# EAGLE design RF22BController_v01 (EAGLE 6.4)
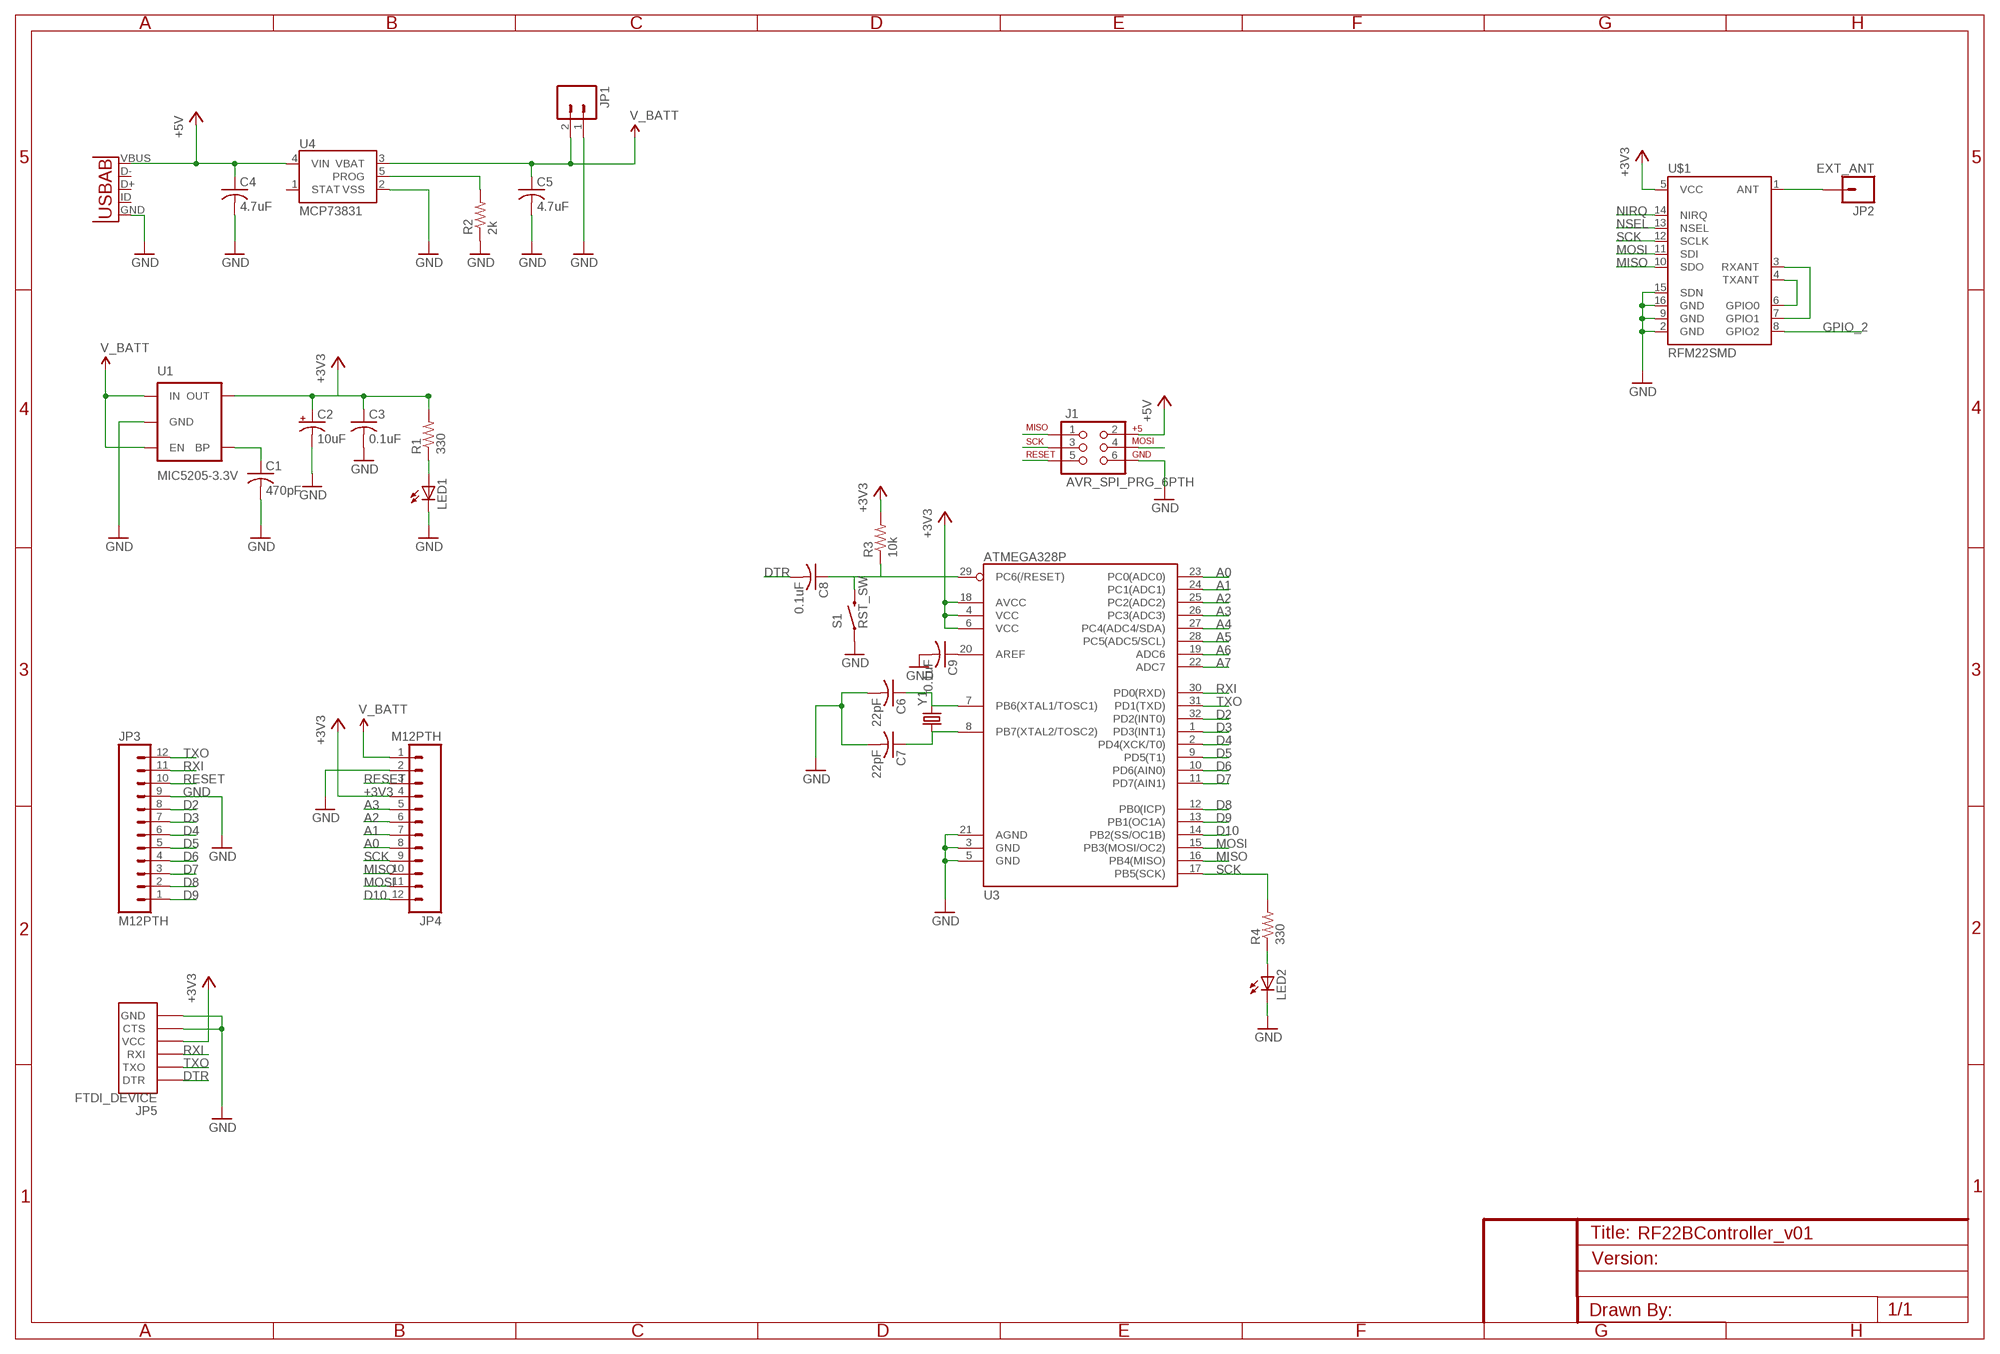
[diagram p0: schematic, sheet 1]

## Parts
C1  470pF  C-USC0805  [C0805]
C2  10uF  CPOL-USCT6032  [CT6032]
C3  0.1uF  C-USC0805  [C0805]
C4  4.7uF  C-USC0805  [C0805]
C5  4.7uF  C-USC0805  [C0805]
C6  22pF  C-USC0805  [C0805]
C7  22pF  C-USC0805  [C0805]
C8  0.1uF  C-USC0805  [C0805]
C9  0.1uF  C-USC0805  [C0805]
J1  AVR_SPI_PRG_6PTH  [2X3]
JP1  M02-JST-2MM-SMT  [JST-2-SMD]
JP2  EXT_ANT  M01PTH  [1X01]
JP3  M12PTH  [1X12]
JP4  M12PTH  [1X12]
JP5  FTDI_DEVICE  [FTDI_DEVICE_SIDE]
LED1  LEDCHIP-LED0603  [CHIP-LED0603]
LED2  LEDCHIP-LED0603  [CHIP-LED0603]
R1  330  R-US_M0805  [M0805]
R2  2k  R-US_M0805  [M0805]
R3  10k  R-US_M0805  [M0805]
R4  330  R-US_M0805  [M0805]
S1  RST_SW  SWITCH-MOMENTARY-2  [TACTILE_SWITCH_TALL]
U1  MIC5205-3.3V  MIC52053.3V  [SOT23-5]
U2  USB-AB  [USB-AB-MICRO-SMD]
U3  ATMEGA328P  ATMEGA328_SMT  [TQFP32-08]
U4  MCP73831  [SOT23-5]
U$1  RFM22SMD  [RFM22-XXX-S2]
Y1  CRYSTALTXC-7A  [CRYSTAL-TXC-7A]

## Nets
+3V3: C2.+ C3.1 JP4.4 JP5.P$4(VCC) R1.2 R3.2 U1.5(OUT) U3.4(VCC) U3.6(VCC) U3.18(AVCC) U$1.5(VCC)
+5V: C4.1 J1.2 U2.VBUS U4.4(VIN)
A0: JP4.8 U3.23(PC0(ADC0))
A1: JP4.7 U3.24(PC1(ADC1))
A2: JP4.6 U3.25(PC2(ADC2))
A3: JP4.5 U3.26(PC3(ADC3))
A4: U3.27(PC4(ADC4/SDA))
A5: U3.28(PC5(ADC5/SCL))
A6: U3.19(ADC6)
A7: U3.22(ADC7)
D2: JP3.8 U3.32(PD2(INT0))
D3: JP3.7 U3.1(PD3(INT1))
D4: JP3.6 U3.2(PD4(XCK/T0))
D5: JP3.5 U3.9(PD5(T1))
D6: JP3.4 U3.10(PD6(AIN0))
D7: JP3.3 U3.11(PD7(AIN1))
D8: JP3.2 U3.12(PB0(ICP))
D9: JP3.1 U3.13(PB1(OC1A))
D10: JP4.12 U3.14(PB2(SS/OC1B))
DTR: C8.2 JP5.P$1(DTR)
GND: C1.2 C2.- C3.2 C4.2 C5.2 C6.2 C7.2 C9.2 J1.6 JP1.1 JP3.9 JP4.2 JP5.P$5(CTS) JP5.P$6(GND) LED1.C LED2.C R2.1 S1.A2 U1.2(GND) U2.GND U3.3(GND) U3.5(GND) U3.21(AGND) U4.2(VSS) U$1.2(GND) U$1.9(GND) U$1.15(SDN) U$1.16(GND)
GPIO_2: U$1.8(GPIO2)
MISO: J1.1 JP4.10 U3.16(PB4(MISO)) U$1.10(SDO)
MOSI: J1.4 JP4.11 U3.15(PB3(MOSI/OC2)) U$1.11(SDI)
N$1: C1.1 U1.4(BP)
N$3: LED1.A R1.1
N$5: U$1.3(RXANT) U$1.7(GPIO1)
N$6: U$1.4(TXANT) U$1.6(GPIO0)
N$7: R2.2 U4.5(PROG)
N$8: C9.1 U3.20(AREF)
N$9: JP2.1 U$1.1(ANT)
N$32: C6.1 U3.7(PB6(XTAL1/TOSC1)) Y1.P$2
N$33: C7.1 U3.8(PB7(XTAL2/TOSC2)) Y1.P$1
N$34: LED2.A R4.1
NIRQ: U$1.14(NIRQ)
NSEL: U$1.13(NSEL)
RESET: C8.1 J1.5 JP3.10 JP4.3 R3.1 S1.B2 U3.29(PC6(/RESET))
RXI: JP3.11 JP5.P$3(RXI) U3.30(PD0(RXD))
SCK: J1.3 JP4.9 R4.2 U3.17(PB5(SCK)) U$1.12(SCLK)
TXO: JP3.12 JP5.P$2(TXO) U3.31(PD1(TXD))
V_BATT: C5.1 JP1.2 JP4.1 U1.1(IN) U1.3(EN) U4.3(VBAT)
Unconnected: U2.D+ U2.D- U2.ID(USBID) U4.1(STAT)

## Library data of the parts
C1 C3-C9 = rcl:C-US: CAPACITOR, American symbol
C2 = rcl:CPOL-US: POLARIZED CAPACITOR, American symbol
J1 = SparkFun-Connectors:AVR_SPI_PRG_6: AVR ISP 6 Pin This is the reduced ISP connector for AVR programming. Common on Arduino. This footprint will take up less PCB space and can be used with a 10-pin to 6-pin adapter such as SKU: BOB-08508
JP1 = SparkFun-Connectors:M02: Header 2 Standard 2-pin 0.1" header. Use with straight break away headers (SKU : PRT-00116), right angle break away headers (PRT-00553), swiss pins (PRT-00743), machine pins (PRT-00117), and female headers (PRT-00115). Molex polarized connector foot print use with SKU : PRT-08233 with associated crimp pins and housings.; PROD_ID: CONN-08352
JP2 = SparkFun-Connectors:M01: Header 1 Standard 1-pin 0.1" header. Use with straight break away headers (SKU : PRT-00116), right angle break away headers (PRT-00553), swiss pins (PRT-00743), machine pins (PRT-00117), and female headers (PRT-00115).
JP3 JP4 = SparkFun-Connectors:M12: Header 12 Standard 12-pin 0.1" header. Use with straight break away headers (SKU : PRT-00116), right angle break away headers (PRT-00553), swiss pins (PRT-00743), machine pins (PRT-00117), and female headers (PRT-00115).
JP5 = SparkFun-Connectors:FTDI_DEVICE: Connector which mates to FTDI basic or FTDI cable.
LED1 LED2 = led:LED: LED OSRAM: - CHIPLED LG R971, LG N971, LY N971, LG Q971, LY Q971, LO R971, LY R971 LH N974, LH R974 LS Q976, LO Q976, LY Q976 LO Q996 - Hyper CHIPLED LW Q18S LB Q993, LB Q99A, LB R99A - SideLED LS A670, LO A670, LY A670, LG A670, LP A670 LB A673, LV A673, LT A673, LW A673 LH A674 LY A675 LS A676, LA A676, LO A676, LY A676, LW A676 LS A679, LY A679, LG A679 - Hyper Micro SIDELED® LS Y876, LA Y876, LO Y876, LY Y876 LT Y87S - SmartLED LW L88C, LW L88S LB L89C, LB L89S, LG L890 LS L89K, LO L89K, LY L89K LS L896, LA L896, LO L896, LY L896 - TOPLED LS T670, LO T670, LY T670, LG T670, LP T670 LSG T670, LSP T670, LSY T670, LOP T670, LYG T670 LG T671, LOG T671, LSG T671 LB T673, LV T673, LT T673, LW T673 LH T674 LS T676, LA T676, LO T676, LY T676, LB T676, LH T676, LSB T676, LW T676 LB T67C, LV T67C, LT T67C, LS T67K, LO T67K, LY T67K, LW E67C LS E67B, LA E67B, LO E67B, LY E67B, LB E67C, LV E67C, LT E67C LW T67C LS T679, LY T679, LG T679 LS T770, LO T770, LY T770, LG T770, LP T770 LB T773, LV T773, LT T773, LW T773 LH T774 LS E675, LA E675, LY E675, LS T675 LS T776, LA T776, LO T776, LY T776, LB T776 LHGB T686 LT T68C, LB T68C - Hyper Mini TOPLED® LB M676 - Mini TOPLED Santana® LG M470 LS M47K, LO M47K, LY M47K Source: http://www.osram.convergy.de LUXEON: - LUMILED® LXK2-PW12-R00, LXK2-PW12-S00, LXK2-PW14-U00, LXK2-PW14-V00 LXK2-PM12-R00, LXK2-PM12-S00, LXK2-PM14-U00 LXK2-PE12-Q00, LXK2-PE12-R00, LXK2-PE12-S00, LXK2-PE14-T00, LXK2-PE14-U00 LXK2-PB12-K00, LXK2-PB12-L00, LXK2-PB12-M00, LXK2-PB14-N00, LXK2-PB14-P00, LXK2-PB14-Q00 LXK2-PR12-L00, LXK2-PR12-M00, LXK2-PR14-Q00, LXK2-PR14-R00 LXK2-PD12-Q00, LXK2-PD12-R00, LXK2-PD12-S00 LXK2-PH12-R00, LXK2-PH12-S00 LXK2-PL12-P00, LXK2-PL12-Q00, LXK2-PL12-R00 Source: www.luxeon.com KINGBRIGHT: KA-3528ASYC Source: www.kingbright.com
R1-R4 = rcl:R-US_: RESISTOR, American symbol
S1 = SparkFun-Electromechanical:SWITCH-MOMENTARY-2: Various NO switches- pushbuttons, reed, etc
U1 = SparkFun-PowerIC:MIC5205: MIC5205 150mA vreg 3.3V - VREG-00822 5V - VREG-00823; PROD_ID: VREG-00822
U2 = SparkFun-Connectors:USB-AB: This is a USB AB connector that is compatible with USB OTG. i.e. this connector can serve as a host or device
U3 = SparkFun-DigitalIC:ATMEGA328_SMT: 32-Pin Atmega328 part Commonly used on Arduino compatible boards Available in QFP and QFN packages TQFP is IC-09069 QFN is non-stock; PROD_ID: IC-09069
U4 = SparkFun-PowerIC:MCP73831: Miniature single cell, fully integrated Li-Ion, Li-polymer charge management controller http://ww1.microchip.com/downloads/en/DeviceDoc/21984a.pdf IC-09995; PROD_ID: IC-09995
U$1 = SparkFun-RF:RFM22: The RFM22 is a low-power, low cost radio that is capable of operating in the 434MHz and 900MHz open bands. It's frequency is software defined and there are some very good libraries written for it.
Y1 = SparkFun-FreqCtrl:CRYSTAL: Various standard crystals. Proven footprints. Spark Fun Electronics SKU : COM-00534

## Board
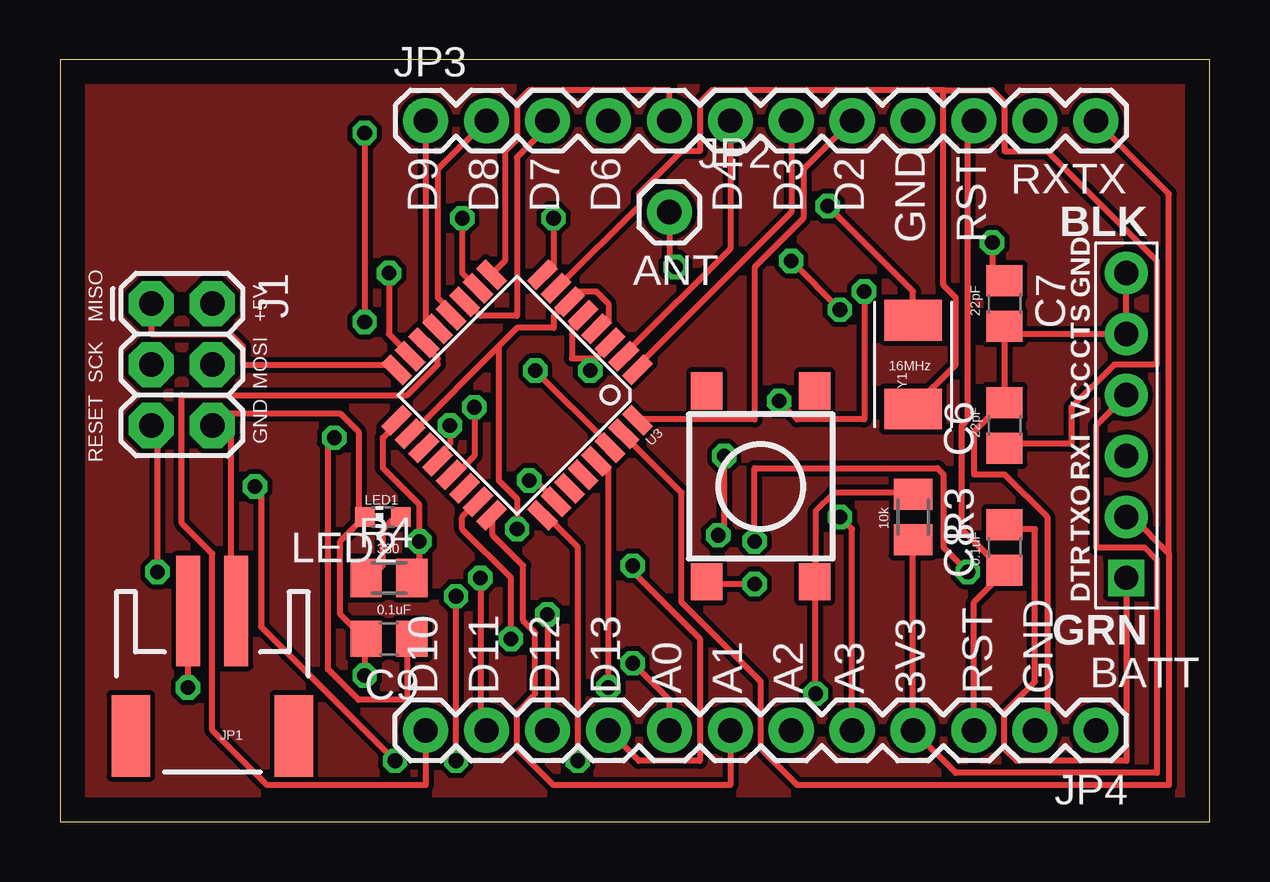
[diagram p1: board, top side]
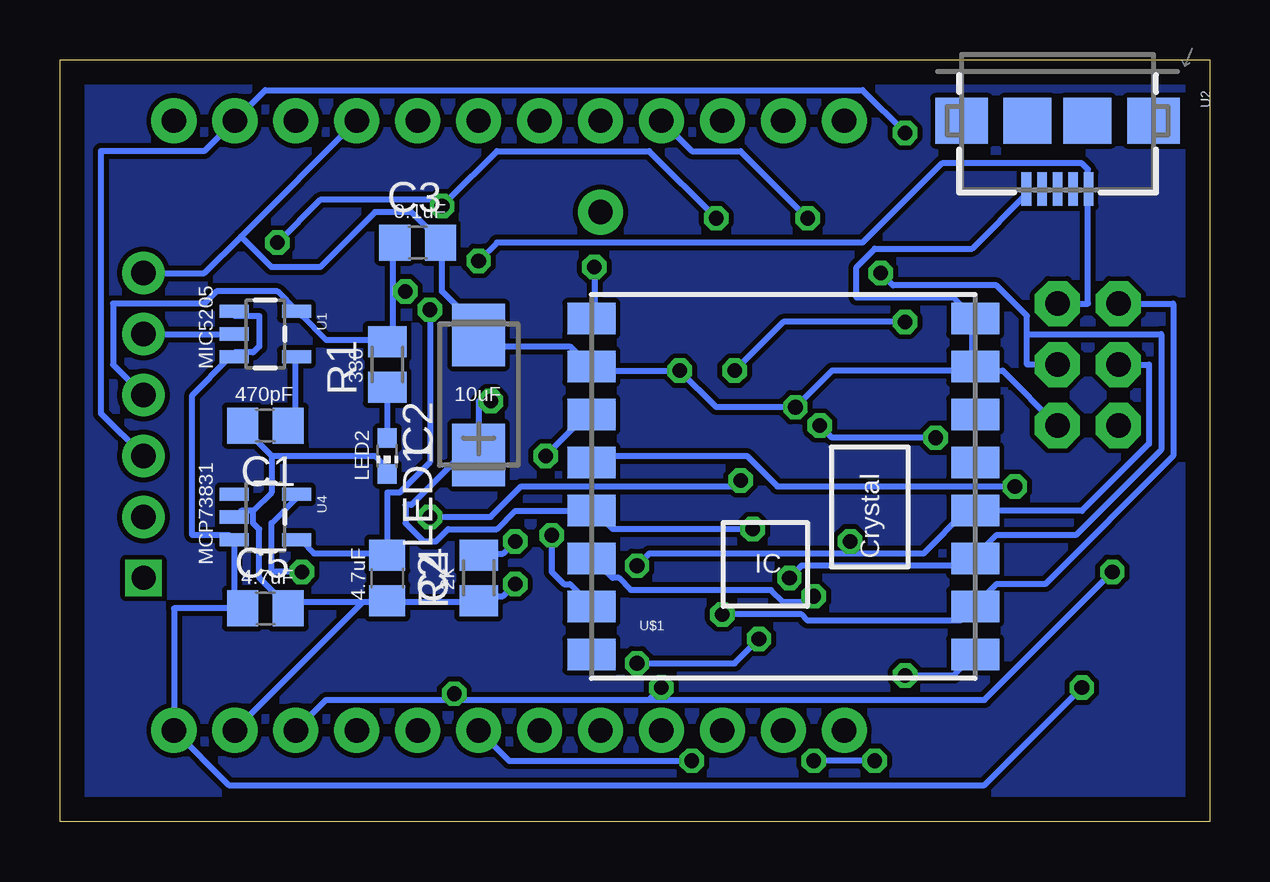
[diagram p2: board, bottom side, seen from below]

Size 47.93 x 31.74 mm. Coordinates in mm from the lower left corner, seen from the top.
Outline: 0,0 47.93,0 47.93,31.74 0,31.74 0,0
Copper layers (1*16): Top 0.035mm / dielectric 1.5mm / Bottom 0.035mm
Design rules "default": minimum track width 10mil, minimum drill 24mil, track to track 8mil, track to pad 8mil, pad to pad 8mil, via to via 8mil, smd to smd 8mil, copper to edge 40mil, drill to drill 8mil, minimum pad ring 10mil, minimum via ring 8mil, stop-mask expansion 4mil, vias tented up to drill 0mil, thermal gap 10mil

### Footprints (pad centres in the part's own frame; a part is rotated, then mirrored left to right if it is on the bottom)
C0805 = smd 1.3 x 1.5: 1 -0.95,0; 2 0.95,0
CT6032 = smd 2.6 x 2.2: + -2.5,0; - 2.5,0
2X3 = drill 1.016 pad 1.88 octagon: 1 0,0; 2 0,2.54; 3 2.54,0; 4 2.54,2.54; 5 5.08,0; 6 5.08,2.54
JST-2-SMD = smd 1 x 4.6: 1 -1,-3.7; 2 1,-3.7 | smd 1.6 x 3.4: NC1 -3.4,1.5; NC2 3.4,1.5
1X01 = drill 1.016 pad 1.88: 1 0,0
1X12 = drill 1.016 pad 1.88: 1 0,0; 2 2.54,0; 3 5.08,0; 4 7.62,0; 5 10.16,0; 6 12.7,0; 7 15.24,0; 8 17.78,0; 9 20.32,0; 10 22.86,0; 11 25.4,0; 12 27.94,0
FTDI_DEVICE_SIDE = drill 1 square: P$1 -6.35,0 | drill 1.016 pad 1.778: P$2 -3.81,0; P$3 -1.27,0; P$4 1.27,0; P$5 3.81,0; P$6 6.35,0
CHIP-LED0603 = smd 0.8 x 0.8: A 0,-0.75; C 0,0.75
M0805 = smd 1.3 x 1.6: 1 -0.95,0; 2 0.95,0
TACTILE_SWITCH_TALL = smd 1.55 x 1.3: A1 -3.975,-2.25; A2 3.975,-2.25; B1 -3.975,2.25; B2 3.975,2.25
SOT23-5 = smd 0.55 x 1.2: 1 -0.95,-1.3; 2 0,-1.3; 3 0.95,-1.3; 4 0.95,1.3; 5 -0.95,1.3
USB-AB-MICRO-SMD = smd 1.4 x 0.4: D+ 2.85,0; D- 2.85,0.65; GND 2.85,-1.3; ID 2.85,-0.65; VBUS 2.85,1.3 | smd 1.9 x 2: P$6 0,1.25; P$7 0,-1.25 | smd 1.9 x 2.2: P$8 0,4; P$9 0,-4
TQFP32-08 = smd 1.27 x 0.559: 1 -4.293,2.8; 2 -4.293,2; 3 -4.293,1.2; 4 -4.293,0.4; 5 -4.293,-0.4; 6 -4.293,-1.2; 7 -4.293,-2; 8 -4.293,-2.8; 17 4.293,-2.8; 18 4.293,-2; 19 4.293,-1.2; 20 4.293,-0.4; 21 4.293,0.4; 22 4.293,1.2; 23 4.293,2; 24 4.293,2.8 | smd 0.559 x 1.27: 9 -2.8,-4.293; 10 -2,-4.293; 11 -1.2,-4.293; 12 -0.4,-4.293; 13 0.4,-4.293; 14 1.2,-4.293; 15 2,-4.293; 16 2.8,-4.293; 25 2.8,4.293; 26 2,4.293; 27 1.2,4.293; 28 0.4,4.293; 29 -0.4,4.293; 30 -1.2,4.293; 31 -2,4.293; 32 -2.8,4.293
RFM22-XXX-S2 = smd 2 x 1.3: 1 -8,7; 2 -8,5; 3 -8,3; 4 -8,1; 5 -8,-1; 6 -8,-3; 7 -8,-5; 8 -8,-7; 9 8,-7; 10 8,-5; 11 8,-3; 12 8,-1; 13 8,1; 14 8,3; 15 8,5; 16 8,7
CRYSTAL-TXC-7A = smd 1.7 x 2.4: P$1 1.85,0; P$2 -1.85,0

### Placement (x,y rotation side)
C1  39.37,16.51 180 bottom
C2  30.48,17.78 90 bottom
C3  33.02,24.13 0 bottom
C4  34.29,10.16 270 bottom
C5  39.37,8.89 0 bottom
C6  39.37,16.51 90 top
C7  39.37,21.59 270 top
C8  39.37,11.43 90 top
C9  13.72,7.62 180 top
J1  3.81,21.59 270 top
JP1  6.35,5.08 180 top
JP2  25.4,25.4 0 top
JP3  15.24,29.21 0 top
JP4  43.18,3.81 180 top
JP5  44.45,16.51 90 top
LED1  34.29,15.24 180 bottom
LED2  13.46,12.7 90 top
R1  34.29,19.05 90 bottom
R2  30.48,10.16 90 bottom
R3  35.56,12.7 270 top
R4  13.72,10.16 0 top
S1  29.21,13.97 270 top
U1  39.37,20.32 270 bottom
U2  6.35,29.21 270 bottom
U3  19.05,17.78 225 top
U4  39.37,12.7 270 bottom
U$1  17.78,13.97 0 bottom
Y1  35.56,19.05 90 top

### Tracks (layer width: path | path; a pad name or v marks a point on that pad's centre or on a via)
+3V3  (via drill 0.61)
  Top 0.254: 18.29,19.81 19.05,20.57 20.57,20.57 20.57,21.08 21.08,21.59 U3.6 21.34,21.84 21.59,22.1 22.35,22.1 22.86,21.59 22.86,20.83 22.61,20.57 U3.4 | 18.29,19.81 14.73,16.26 U3.18 | v19.05,12.19 19.05,13.46 18.29,14.22 18.29,19.81 | R3.2 JP4.4 37.34,2.03 45.72,2.03 45.72,10.92 45.21,11.43 43.18,11.43 43.18,16.51 JP5.P$4 | v29.97,17.53 30.73,16.76 33.53,16.76 v33.53,22.1
  Bottom 0.254: v19.05,12.19 24.89,12.19 25.65,12.95 U$1.5 25.91,12.95 28.96,12.95 29.72,12.19 31.75,12.19 32.26,11.68 32.77,11.68 33.53,12.45 33.53,13.21 33.27,13.21 31.24,15.24 30.48,15.24 C2.+ 30.48,17.53 v29.97,17.53 | 34.29,20.07 36.83,20.07 37.85,21.08 U1.5 38.1,21.34 38.86,22.1 41.4,22.1 41.91,21.59 45.72,21.59 45.72,19.05 JP5.P$4 | 34.04,22.1 34.04,20.07 34.29,20.07 | 34.04,22.1 34.04,24.13 C3.1 | 34.29,20.07 R1.2 | 34.04,22.1 v33.53,22.1
+5V  (via drill 0.61)
  Top 0.254: v30.48,23.37 v32.51,21.34
  Bottom 0.254: 34.29,11.18 37.34,11.18 37.85,11.68 U4.4 | J1.2 5.08,21.59 5.08,26.16 U2.VBUS 5.08,26.42 5.08,27.18 5.33,27.43 11.18,27.43 14.48,24.13 29.72,24.13 v30.48,23.37 | 34.29,11.18 34.29,13.72 33.78,13.72 32.51,14.99 v32.51,21.34 | 34.29,11.18 C4.1
A0  (via drill 0.61)
  Top 0.254: v18.8,7.62 18.8,10.16 16.76,12.19 16.76,12.7 17.27,13.21 U3.23 | v23.88,6.6 25.4,5.08 JP4.8
  Bottom 0.254: v18.8,7.62 19.81,6.6 v23.88,6.6
A1
  Top 0.254: JP4.7 27.94,1.52 20.57,1.52 19.05,3.05 19.05,4.57 19.81,5.33 19.81,7.87 19.3,8.38 19.3,10.67 18.03,11.94 18.03,12.7 U3.24
A2  (via drill 0.61)
  Top 0.254: v21.59,2.54 21.59,11.43 20.32,12.7 U3.25
  Bottom 0.254: v21.59,2.54 29.21,2.54 JP4.6
A3  (via drill 0.61)
  Top 0.254: v19.56,14.22 19.81,14.22 20.57,13.46 U3.26 | v32.51,12.7 33.02,12.19 JP4.5
  Bottom 0.254: v19.56,14.22 19.81,13.97 28.7,13.97 29.97,12.7 v32.51,12.7
D2
  Top 0.254: JP3.8 30.99,27.18 30.99,25.15 28.96,23.11 28.96,16.76 24.13,16.76 U3.32
D3
  Top 0.254: JP3.7 30.48,25.4 24.13,19.05 U3.1
D4
  Top 0.254: JP3.6 27.94,23.88 23.62,19.56 U3.2
D5
  Top 0.254: JP3.5 25.4,30.48 19.56,30.48 19.05,29.97 19.05,28.45 18.54,27.94 18.54,23.37 18.03,22.86 U3.9
D6  (via drill 0.61)
  Top 0.254: v16.76,25.15 16.76,22.86 17.27,22.35 U3.10
  Bottom 0.254: v16.76,25.15 19.56,27.94 21.59,27.94 JP3.4
D7
  Top 0.254: JP3.3 20.32,28.96 19.05,27.69 19.05,21.08 17.53,21.08 17.02,21.59 U3.11
D8
  Top 0.254: JP3.2 15.75,27.18 15.75,21.84 16.26,21.34 U3.12
D9
  Top 0.254: JP3.1 15.24,20.83 15.49,20.57 U3.13
D10
  Top 0.254: JP4.12 15.24,1.52 8.64,1.52 6.35,3.81 6.35,11.18 5.08,12.45 5.08,17.78 14.48,17.78 15.75,19.05 15.75,19.3 15.24,19.81 U3.14
DTR
  Top 0.254: JP5.P$1 44.45,2.54 39.88,2.54 39.37,3.05 39.37,4.57 40.64,5.84 40.64,12.19 39.37,12.19 C8.2
GND  (via drill 0.61)
  Top 0.254: v28.96,9.91 27.18,9.91 S1.A2 | 39.37,20.32 C7.2 39.37,20.57 | 39.37,20.32 39.37,17.53 | 39.37,20.32 JP5.P$5 JP5.P$6 | 22.1,19.3 21.34,19.3 21.34,20.83 21.59,21.08 U3.5 | 22.1,19.3 22.35,19.3 22.86,19.81 U3.3 | v22.1,18.8 22.1,19.3 | LED2.C 11.68,11.68 11.68,8.64 12.7,7.62 | 12.7,7.62 v12.7,6.1 | 12.7,7.62 C9.2 | v17.27,17.27 17.27,15.24 16.51,14.48 U3.21 | LED2.C 12.45,12.95 12.45,16.26 11.68,17.02 7.11,17.02 | 7.11,17.02 6.35,17.02 J1.6 7.11,17.02 | LED2.C | 7.11,17.02 7.11,8.89 JP1.1 | JP4.2 41.15,4.32 41.15,12.7 39.37,14.48 38.1,14.48 38.1,16.26 39.37,17.53 | 39.37,17.53 C6.2
  Bottom 0.254: 39.12,15.24 34.8,15.24 34.29,14.73 LED1.C | 39.12,15.24 40.39,16.51 C1.2 | 39.88,12.95 40.39,12.95 40.64,12.7 U4.2 | 39.88,12.95 39.12,13.72 39.12,15.24 | 34.29,9.14 30.48,9.14 R2.1 30.48,9.4 29.46,9.4 v28.96,9.91 | 38.35,8.89 38.1,9.14 35.31,9.14 | 34.29,9.14 35.31,9.14 | 34.29,9.14 C4.2 | 35.31,9.14 JP4.2 | 39.88,12.95 39.88,12.45 39.62,12.19 39.62,10.16 38.35,8.89 | 38.35,8.89 C5.2 | JP5.P$5 U1.2 | 40.39,24.38 41.91,22.86 JP5.P$6 | 40.39,24.38 JP3.9 | 32,24.13 32,22.1 30.48,20.57 C2.- 30.48,20.07 30.23,19.81 26.67,19.81 25.91,19.05 U$1.2 25.65,18.8 v22.1,18.8 20.57,17.27 v17.27,17.27 15.75,18.8 9.91,18.8 U$1.15 | U2.GND 7.62,26.16 9.91,23.88 13.97,23.88 14.73,23.11 14.73,21.84 10.67,21.84 9.91,21.08 U$1.16 9.91,20.83 9.91,19.05 U$1.15 | v12.7,6.1 10.67,6.1 9.91,6.86 U$1.9 | J1.6 8.64,18.8 9.65,18.8 U$1.15 | 40.39,24.38 39.12,23.11 37.08,23.11 34.8,25.4 33.27,25.4 32,24.13 | 32,24.13 C3.2
MISO  (via drill 0.61)
  Top 0.254: J1.1 3.81,20.32 7.11,20.32 7.62,19.81 7.62,19.05 13.97,19.05 U3.16 | v20.32,8.64 JP4.10
  Bottom 0.254: J1.1 1.52,21.59 1.52,15.24 6.86,9.91 8.89,9.91 9.65,9.14 U$1.10 9.91,8.89 10.41,8.38 16.76,8.38 17.02,8.64 v20.32,8.64
MOSI  (via drill 0.61)
  Top 0.254: v13.72,22.86 13.72,20.32 14.48,19.56 U3.15 | JP4.11 17.53,4.06 v17.53,10.16
  Bottom 0.254: v13.72,22.86 13.21,22.35 8.89,22.35 7.62,21.08 7.62,20.32 | 7.62,20.32 7.62,19.05 J1.4 | 7.62,20.32 2.03,20.32 2.03,15.49 5.59,11.94 8.89,11.94 9.65,11.18 U$1.11 9.91,10.92 10.16,10.67 17.02,10.67 v17.53,10.16
N$1
  Bottom 0.254: C1.1 38.1,16.51 38.1,19.3 U1.4
N$2
  pour Bottom: 0,31.75 48.26,31.75 48.26,0 0,0
N$3
  Bottom 0.254: R1.1 LED1.A
N$4
  pour Top: 0,31.75 48.26,31.75 48.26,0 0,0
N$5  (via drill 0.61)
  Top 0.254: v27.43,11.94 27.69,12.19 v27.69,15.24
  Bottom 0.254: v27.43,11.94 27.43,10.41 26.92,9.91 26.67,9.91 25.91,9.14 U$1.7 | v27.69,15.24 26.16,16.76 25.91,16.76 U$1.3
N$6  (via drill 0.61)
  Top 0.254: v16.51,2.54 v16.51,9.4 | v13.97,2.54 8.38,8.13 8.38,13.72 v8.13,13.97
  Bottom 0.254: v16.51,9.4 16.76,9.14 17.78,9.14 18.29,9.65 24.13,9.65 24.64,10.16 24.89,10.16 25.65,10.92 U$1.6 | v13.97,2.54 v16.51,2.54 | v8.13,13.97 18.03,13.97 19.3,15.24 25.4,15.24 25.65,14.99 U$1.4
N$7  (via drill 0.61)
  Top 0.254: v37.85,10.41 36.83,11.43 36.83,14.48 36.58,14.73 28.96,14.73 v28.96,11.68
  Bottom 0.254: v37.85,10.41 39.12,10.41 39.12,12.45 38.1,13.46 U4.5 | v28.96,11.68 29.46,11.18 30.48,11.18 R2.2
N$8  (via drill 0.61)
  Top 0.254: v16.26,16.51 16.26,15.75 15.75,15.24 U3.20 | v11.43,16 11.18,15.75 11.18,6.35 12.45,5.08 14.48,5.08 14.48,7.62 C9.1
  Bottom 0.254: v16.26,16.51 15.75,16 v11.43,16
N$9  (via drill 0.61)
  Top 0.254: v25.65,23.11 25.4,23.37 JP2.1
  Bottom 0.254: v25.65,23.11 25.65,21.08 U$1.1
N$32
  Top 0.254: 36.83,30.48 27.18,30.48 26.67,29.97 26.67,27.94 25.91,27.94 24.13,26.16 24.13,25.65 20.83,22.35 U3.7 | 36.83,30.48 36.83,22.35 37.34,21.84 37.34,19.05 35.56,17.27 Y1.P$2 | 36.83,30.48 38.86,30.48 39.37,29.97 39.37,27.94 41.15,27.94 45.72,23.37 45.72,19.05 43.94,19.05 42.16,17.27 42.16,15.75 39.37,15.75 C6.1
N$33  (via drill 0.61)
  Top 0.254: v20.57,25.15 20.57,23.11 20.32,22.86 U3.8 | v32,25.65 35.56,22.1 Y1.P$1 | v38.86,24.13 38.86,23.11 39.37,22.61 C7.1
  Bottom 0.254: v20.57,25.15 23.37,27.94 29.72,27.94 31.75,25.91 | v38.86,24.13 37.08,25.91 31.75,25.91 | 31.75,25.91 v32,25.65
N$34
  Top 0.254: LED2.A 13.97,12.7 13.46,12.19 13.46,10.67 12.95,10.16 R4.1
RESET  (via drill 0.61)
  Top 0.254: R3.1 35.56,13.72 32.26,13.72 31.5,12.95 31.5,10.16 S1.B2 31.5,9.91 v31.5,5.33 | v22.86,5.59 22.86,14.73 22.61,14.99 U3.29 | 39.37,10.41 38.1,9.14 JP4.3 | J1.5 4.06,16.26 v4.06,10.41 | JP3.10 37.85,28.96 37.85,16.76 37.59,16.51 37.59,12.19 39.37,10.41 | 39.37,10.41 C8.1
  Bottom 0.254: 23.37,5.08 v22.86,5.59 | 31.5,5.08 36.83,5.08 JP4.3 | 31.5,5.08 23.37,5.08 | v4.06,10.41 9.4,5.08 23.37,5.08 | 31.5,5.08 v31.5,5.33
RXI  (via drill 0.61)
  Top 0.254: v19.81,18.8 22.86,15.75 U3.30 | v12.7,28.7 v12.7,20.83
  Bottom 0.254: v19.81,18.8 17.78,20.83 v12.7,20.83 | v12.7,28.7 14.48,30.48 39.37,30.48 JP3.11 41.91,27.94 46.23,27.94 46.23,17.02 JP5.P$3
SCK  (via drill 0.61)
  Top 0.254: U3.17 13.97,16.51 13.46,16 13.46,14.73 14.99,13.21 v14.99,11.68 14.99,10.41 14.73,10.16 R4.2 | JP4.9 24.13,2.54 26.67,2.54 26.67,7.62 23.88,10.41 v23.88,10.67
  Bottom 0.254: J1.3 2.54,19.05 2.54,15.75 5.33,12.95 9.65,12.95 U$1.12 9.91,12.95 10.16,12.95 11.94,11.18 14.99,11.18 | v23.88,10.67 23.37,11.18 14.99,11.18 | 14.99,11.18 v14.99,11.68
TXO
  Top 0.254: 46.23,11.18 46.23,1.52 30.73,1.52 29.21,3.05 29.21,5.84 25.91,9.14 25.91,13.72 23.62,16 U3.31 | 46.23,11.18 44.7,12.7 JP5.P$2 | JP3.12 46.23,26.16 46.23,11.18
V_BATT  (via drill 0.61)
  Top 0.254: v5.33,5.59 5.33,8.64 JP1.2
  Bottom 0.254: U1.1 40.64,21.08 39.62,21.08 39.62,19.81 39.88,19.56 40.64,19.56 U1.3 40.89,19.3 42.42,17.78 42.42,11.94 40.89,11.94 U4.3 40.64,11.68 40.64,8.89 | 40.64,8.89 43.18,8.89 JP4.1 40.89,1.52 9.4,1.52 v5.33,5.59 | 40.64,8.89 C5.1

### Text on the board
tPlace: RX | TX | D9 | D8 | D7 | D6 | D4 | D3 | D2 | GND | RST | ANT | MISO | +5V | 22pF | 16MHz | SCK | MOSI | GND | 22pF | RESET | LED1 | 10k | 330 | 0.1uF | 0.1uF | BATT | D10 | D11 | D12 | D13 | A0 | A1 | A2 | A3 | 3V3 | RST | GND
bPlace: 0.1uF | MIC5205 | 10uF | 330 | 470pF | MCP73831 | LED2 | 4.7uF | 2k | 4.7uF